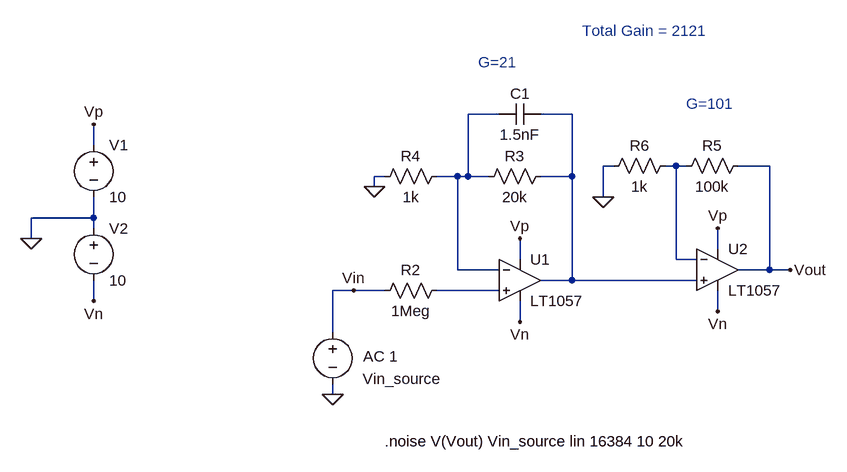
[diagram p0: schematic resistor_based_noise_generator.asc]
resistor_based_noise_generator.asc, the LTspice schematic file:
Version 4
SHEET 1 2236 752
WIRE 336 -480 288 -480
WIRE 448 -480 400 -480
WIRE -288 -432 -288 -464
WIRE 512 -400 496 -400
WIRE 608 -400 592 -400
WIRE 624 -400 608 -400
WIRE 752 -400 704 -400
WIRE 160 -384 144 -384
WIRE 272 -384 240 -384
WIRE 288 -384 288 -480
WIRE 288 -384 272 -384
WIRE 320 -384 288 -384
WIRE 448 -384 448 -480
WIRE 448 -384 400 -384
WIRE 144 -368 144 -384
WIRE 496 -352 496 -400
WIRE -288 -320 -288 -352
WIRE -288 -320 -384 -320
WIRE -288 -304 -288 -320
WIRE -384 -288 -384 -320
WIRE 672 -272 672 -304
WIRE 368 -256 368 -288
WIRE 608 -256 608 -400
WIRE 640 -256 608 -256
WIRE 272 -240 272 -384
WIRE 336 -240 272 -240
WIRE 752 -240 752 -400
WIRE 752 -240 704 -240
WIRE 784 -240 752 -240
WIRE 448 -224 448 -384
WIRE 448 -224 400 -224
WIRE 640 -224 448 -224
WIRE 112 -208 80 -208
WIRE 160 -208 112 -208
WIRE 336 -208 240 -208
WIRE -288 -192 -288 -224
WIRE 672 -176 672 -208
WIRE 368 -160 368 -192
WIRE 80 -144 80 -208
WIRE 80 -48 80 -64
FLAG 80 -48 0
FLAG 112 -208 Vin
FLAG -384 -288 0
FLAG -288 -464 Vp
FLAG 368 -288 Vp
FLAG -288 -192 Vn
FLAG 368 -160 Vn
FLAG 144 -368 0
FLAG 784 -240 Vout
FLAG 672 -304 Vp
FLAG 672 -176 Vn
FLAG 496 -352 0
SYMBOL voltage 80 -160 R0
WINDOW 123 47 53 Left 2
WINDOW 39 0 0 Left 2
WINDOW 0 46 88 Left 2
SYMATTR Value2 AC 1
SYMATTR InstName Vin_source
SYMATTR Value ""
SYMBOL res 256 -224 R90
WINDOW 0 0 56 VBottom 2
WINDOW 3 32 56 VTop 2
SYMATTR InstName R2
SYMATTR Value 1Meg
SYMBOL Opamps\\LT1057 368 -288 R0
SYMATTR InstName U1
SYMBOL voltage -288 -448 R0
WINDOW 123 0 0 Left 0
WINDOW 39 0 0 Left 0
SYMATTR InstName V1
SYMATTR Value 10
SYMBOL voltage -288 -320 R0
WINDOW 123 0 0 Left 0
WINDOW 39 0 0 Left 0
SYMATTR InstName V2
SYMATTR Value 10
SYMBOL res 416 -400 R90
WINDOW 0 0 56 VBottom 2
WINDOW 3 32 56 VTop 2
SYMATTR InstName R3
SYMATTR Value 20k
SYMBOL res 256 -400 R90
WINDOW 0 0 56 VBottom 2
WINDOW 3 32 56 VTop 2
SYMATTR InstName R4
SYMATTR Value 1k
SYMBOL Opamps\\LT1057 672 -304 R0
SYMATTR InstName U2
SYMBOL res 720 -416 R90
WINDOW 0 0 56 VBottom 2
WINDOW 3 32 56 VTop 2
SYMATTR InstName R5
SYMATTR Value 100k
SYMBOL res 608 -416 R90
WINDOW 0 0 56 VBottom 2
WINDOW 3 32 56 VTop 2
SYMATTR InstName R6
SYMATTR Value 1k
SYMBOL cap 400 -496 R90
WINDOW 0 0 32 VBottom 2
WINDOW 3 32 32 VTop 2
SYMATTR InstName C1
SYMATTR Value 1.5nF
TEXT 160 24 Left 2 !.noise V(Vout) Vin_source lin 16384 10 20k
TEXT 304 -560 Left 2 ;G=21
TEXT 624 -496 Left 2 ;G=101
TEXT 464 -608 Left 2 ;Total Gain = 2121

The netlist it stands for:
* resistor_based_noise_generator.asc
Vin_source Vin 0 AC 1
R2 N004 Vin 1Meg
XU1 N004 N001 Vp Vn N002 LT1057  ; pins In+ In- V+ V- OUT
V1 Vp 0 10
V2 0 Vn 10
R3 N002 N001 20k
R4 N001 0 1k
XU2 N002 N003 Vp Vn Vout LT1057  ; pins In+ In- V+ V- OUT
R5 Vout N003 100k
R6 N003 0 1k
C1 N002 N001 1.5nF
.noise V(Vout) Vin_source lin 16384 10 20k
* G=21
* G=101
* Total Gain = 2121
.lib LTC.lib
.backanno
.end